# EAGLE design bristol_longshot (EAGLE 7.3.0)
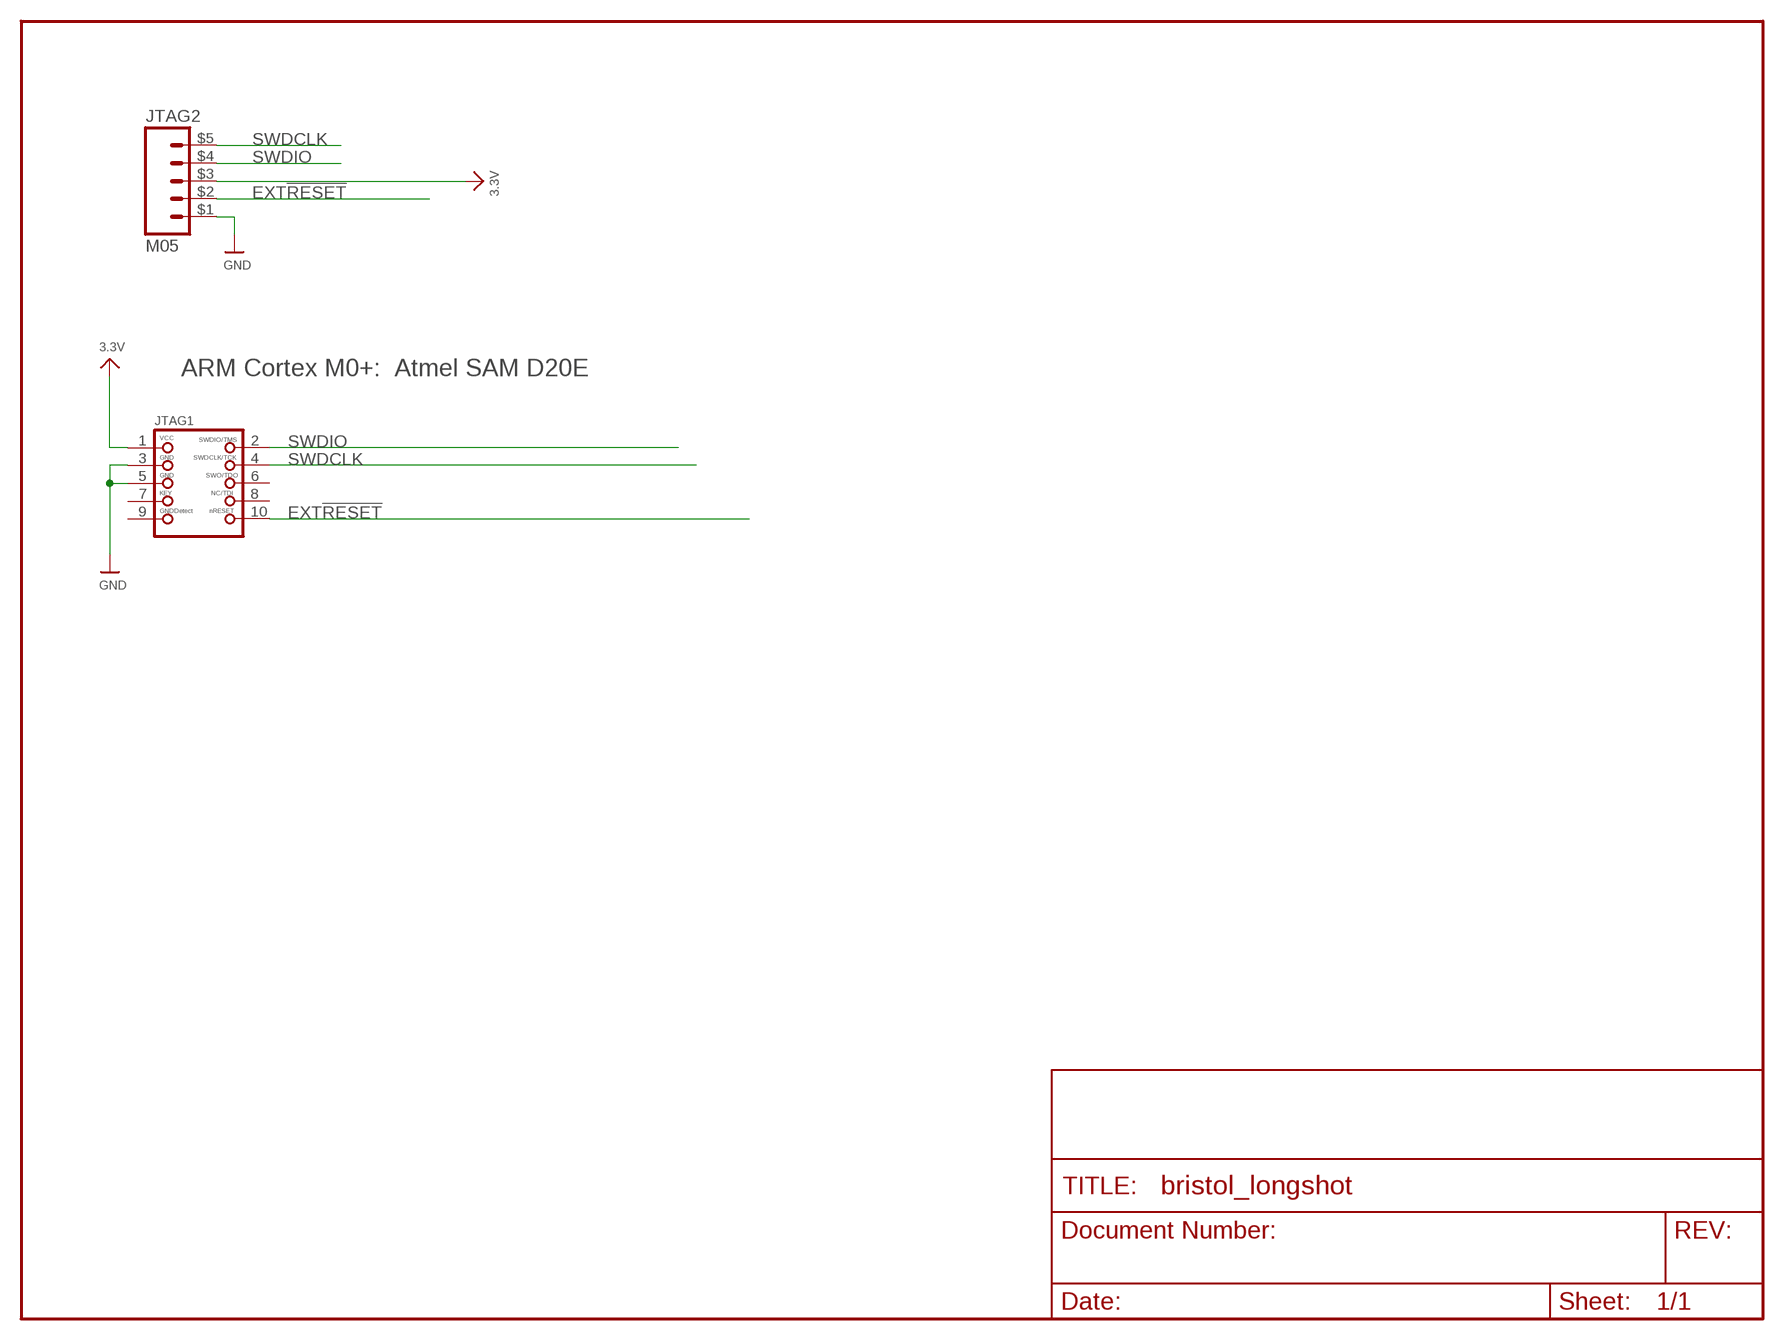
[diagram p0: schematic, sheet 1]

## Parts
JTAG1  JTAG-CORTEXM3SMT  [2X05_1.27MM_SMT]
JTAG2  M05  [M05_SIDE]

## Nets
3.3V: JTAG1.1 JTAG2.$3
EXT!RESET: JTAG1.10 JTAG2.$2
GND: JTAG1.3 JTAG1.5 JTAG2.$1
SWDCLK: JTAG1.4 JTAG2.$5
SWDIO: JTAG1.2 JTAG2.$4
Unconnected: JTAG1.6 JTAG1.7 JTAG1.8 JTAG1.9

## Notes on the sheet
- ARM Cortex M0+:  Atmel SAM D20E

## Library data of the parts
JTAG1 = microbuilder_v3:JTAG-CORTEXM3: Serial Wire (SW-DP) Connector This standard 0.05" 10-pin connector is for use with the Cortex M0/M3's native SWD (serial wire debugger) interface (SW-DP). Some boards support a 20-pin combined JTAG+SWD connector (SWJ-DP), such as the LPC1700 family, but many smaller devices only work with SWD which typically use the smaller 10-pin SW-DP connecter (the LPC1300 family, for example, only supports SWD). 2x05 1.27mm/0.05" Connector: This is the standard SMT connector defined by ARM for all Cortex devices, and should be used in most situations and for forward-compatibility since any new devices coming to market will likely use this connector. MOLEX 10 Pin 0.1" Connector: This 0.1" 10 pin connector has the same pin layout as the standard 0.05" connector, but is easier to work with if you are using standard jumper wires or custom cables to connect your SWD hardware. MOLEX 20 Pin 0.1" Connector: This 0.1" 20 pin connector is the same model used for ARM7/ARM9 JTAG debuggers, but is connected to match the pins on the Segger J-Link for ARM (which supports both JTAG and SWD debugging). See the following document from ARM for more information on Cortex M3 Debug Connectors: http://infocenter.arm.com/help/topic/com.arm.doc.faqs/attached/13634/cortex_debug_connectors.pdf And the following page for an overview with images of the different connector types: http://www.keil.com/peripherals/coresight/connectors.asp
JTAG2 = fbri:M05

## Board
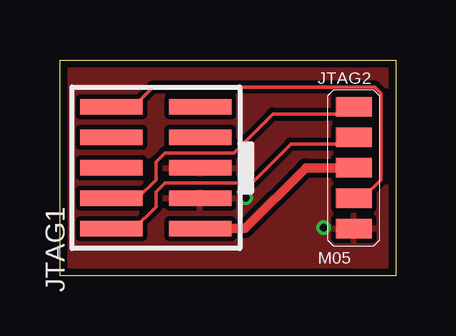
[diagram p1: board, top side]
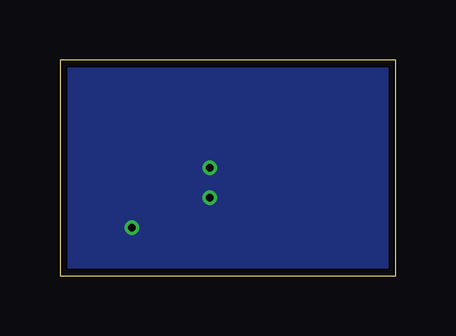
[diagram p2: board, bottom side, seen from below]

Size 14 x 9 mm. Coordinates in mm from the lower left corner, seen from the top.
Outline: 0,0 0,9 14,9 14,0 0,0
Copper layers (1*16): Top 0.035mm / dielectric 1.5mm / Bottom 0.035mm
Design rules "PCB-POOL Standard *": minimum track width 0.15mm, minimum drill 0.3mm, track to track 0.15mm, track to pad 0.15mm, pad to pad 0.15mm, via to via 0.15mm, smd to smd 0.15mm, copper to edge 0.3mm, drill to drill 0.2mm, minimum pad ring 0.2mm, minimum via ring 0.15mm, stop-mask expansion 0.075mm, vias tented up to drill 0.3mm, thermal gap 0.2mm

### Footprints (pad centres in the part's own frame; a part is rotated, then mirrored left to right if it is on the bottom)
2X05_1.27MM_SMT = smd 0.65 x 2.6: 1 -2.54,-1.85; 2 -2.54,1.85; 3 -1.27,-1.85; 4 -1.27,1.85; 5 0,-1.85; 6 0,1.85; 7 1.27,-1.85; 8 1.27,1.85; 9 2.54,-1.85; 10 2.54,1.85
M05_SIDE = smd 1.5 x 0.8: $1 0,-2.54; $2 0,-1.27; $3 0,0; $4 0,1.27; $5 0,2.54

### Placement (x,y rotation side)
JTAG1  4,4.5 90 top
JTAG2  12.25,4.5 0 top

### Tracks (layer width: path | path; a pad name or v marks a point on that pad's centre or on a via)
3.3V
  Top 0.4: JTAG1.1 7.71,1.96 10.25,4.5 JTAG2.$3
EXT!RESET
  Top 0.15: JTAG2.$2 12.61,3.23 13.38,4 13.38,7.62 13.12,7.88 3.88,7.88 3.12,7.12 2.23,7.12 JTAG1.10
GND  (via drill 0.3)
  other vias: 7.75,4.5 7.75,3.25 11,2
  pour Top (isolate 0.2): 0,9 14,9 14,0 0,0
  pour Bottom (isolate 0.2): 0,9 14,9 14,0 0,0
SWDCLK
  Top 0.15: JTAG1.4 3.23,3.23 4,4 4,4.75 4.38,5.12 7.25,5.12 8.88,6.75 11.96,6.75 JTAG2.$5
SWDIO
  Top 0.15: JTAG1.2 3.08,1.96 4,2.88 4,3.5 4.38,3.88 8,3.88 9.62,5.5 11.98,5.5 JTAG2.$4

### Text on the board
tStop: ARM / - / SWD
bStop: UNIVERSITY | BRISTOL